# Altium schematic sheet gad27.SchDoc
size A; SheetNumber: 5; SheetTotal: 20
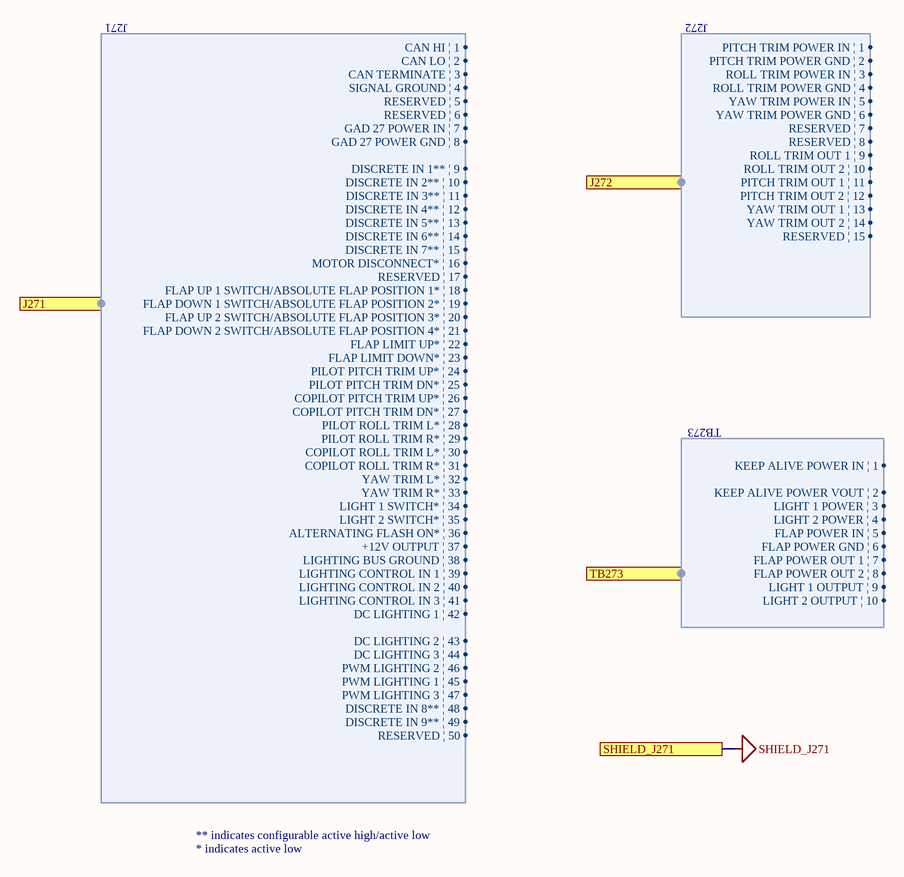
[diagram p0: gad27.SchDoc]

## Ports
J271 (harness J271), J272 (harness J272), SHIELD_J271, TB273 (harness TB273)

## Harnesses
J271: CAN HI | 1, CAN LO | 2, CAN TERMINATE | 3, SIGNAL GROUND | 4, RESERVED | 5, RESERVED | 6, GAD 27 POWER IN | 7, GAD 27 POWER GND | 8, DISCRETE IN 1** | 9, DISCRETE IN 2** | 10, DISCRETE IN 3** | 11, DISCRETE IN 4** | 12, DISCRETE IN 5** | 13, DISCRETE IN 6** | 14, DISCRETE IN 7** | 15, MOTOR DISCONNECT* | 16, RESERVED | 17, FLAP UP 1 SWITCH/ABSOLUTE FLAP POSITION 1* | 18, FLAP DOWN 1 SWITCH/ABSOLUTE FLAP POSITION 2* | 19, FLAP UP 2 SWITCH/ABSOLUTE FLAP POSITION 3* | 20, FLAP DOWN 2 SWITCH/ABSOLUTE FLAP POSITION 4* | 21, FLAP LIMIT UP* | 22, FLAP LIMIT DOWN* | 23, PILOT PITCH TRIM UP* | 24, PILOT PITCH TRIM DN* | 25, COPILOT PITCH TRIM UP* | 26, COPILOT PITCH TRIM DN* | 27, PILOT ROLL TRIM L* | 28, PILOT ROLL TRIM R* | 29, COPILOT ROLL TRIM L* | 30, COPILOT ROLL TRIM R* | 31, YAW TRIM L* | 32, YAW TRIM R* | 33, LIGHT 1 SWITCH* | 34, LIGHT 2 SWITCH* | 35, ALTERNATING FLASH ON* | 36, +12V OUTPUT | 37, LIGHTING BUS GROUND | 38, LIGHTING CONTROL IN 1 | 39, LIGHTING CONTROL IN 2 | 40, LIGHTING CONTROL IN 3 | 41, DC LIGHTING 1 | 42, DC LIGHTING 2 | 43, DC LIGHTING 3 | 44, PWM LIGHTING 2 | 46, PWM LIGHTING 1 | 45, PWM LIGHTING 3 | 47, DISCRETE IN 8** | 48, DISCRETE IN 9** | 49, RESERVED | 50
J272: PITCH TRIM POWER IN | 1, PITCH TRIM POWER GND | 2, ROLL TRIM POWER IN | 3, ROLL TRIM POWER GND | 4, YAW TRIM POWER IN | 5, YAW TRIM POWER GND | 6, RESERVED | 7, RESERVED | 8, ROLL TRIM OUT 1 | 9, ROLL TRIM OUT 2 | 10, PITCH TRIM OUT 1 | 11, PITCH TRIM OUT 2 | 12, YAW TRIM OUT 1 | 13, YAW TRIM OUT 2 | 14, RESERVED | 15
TB273: KEEP ALIVE POWER IN | 1, KEEP ALIVE POWER VOUT | 2, LIGHT 1 POWER | 3, LIGHT 2 POWER | 4, FLAP POWER IN | 5, FLAP POWER GND | 6, FLAP POWER OUT 1 | 7, FLAP POWER OUT 2 | 8, LIGHT 1 OUTPUT | 9, LIGHT 2 OUTPUT | 10

## Nets
SHIELD_J271: port SHIELD_J271

## Notes on the sheet
- ** indicates configurable active high/active low
- * indicates active low